# Altium schematic sheet Main_Sheet.SchDoc
size A4; SheetNumber: 1; SheetTotal: 4
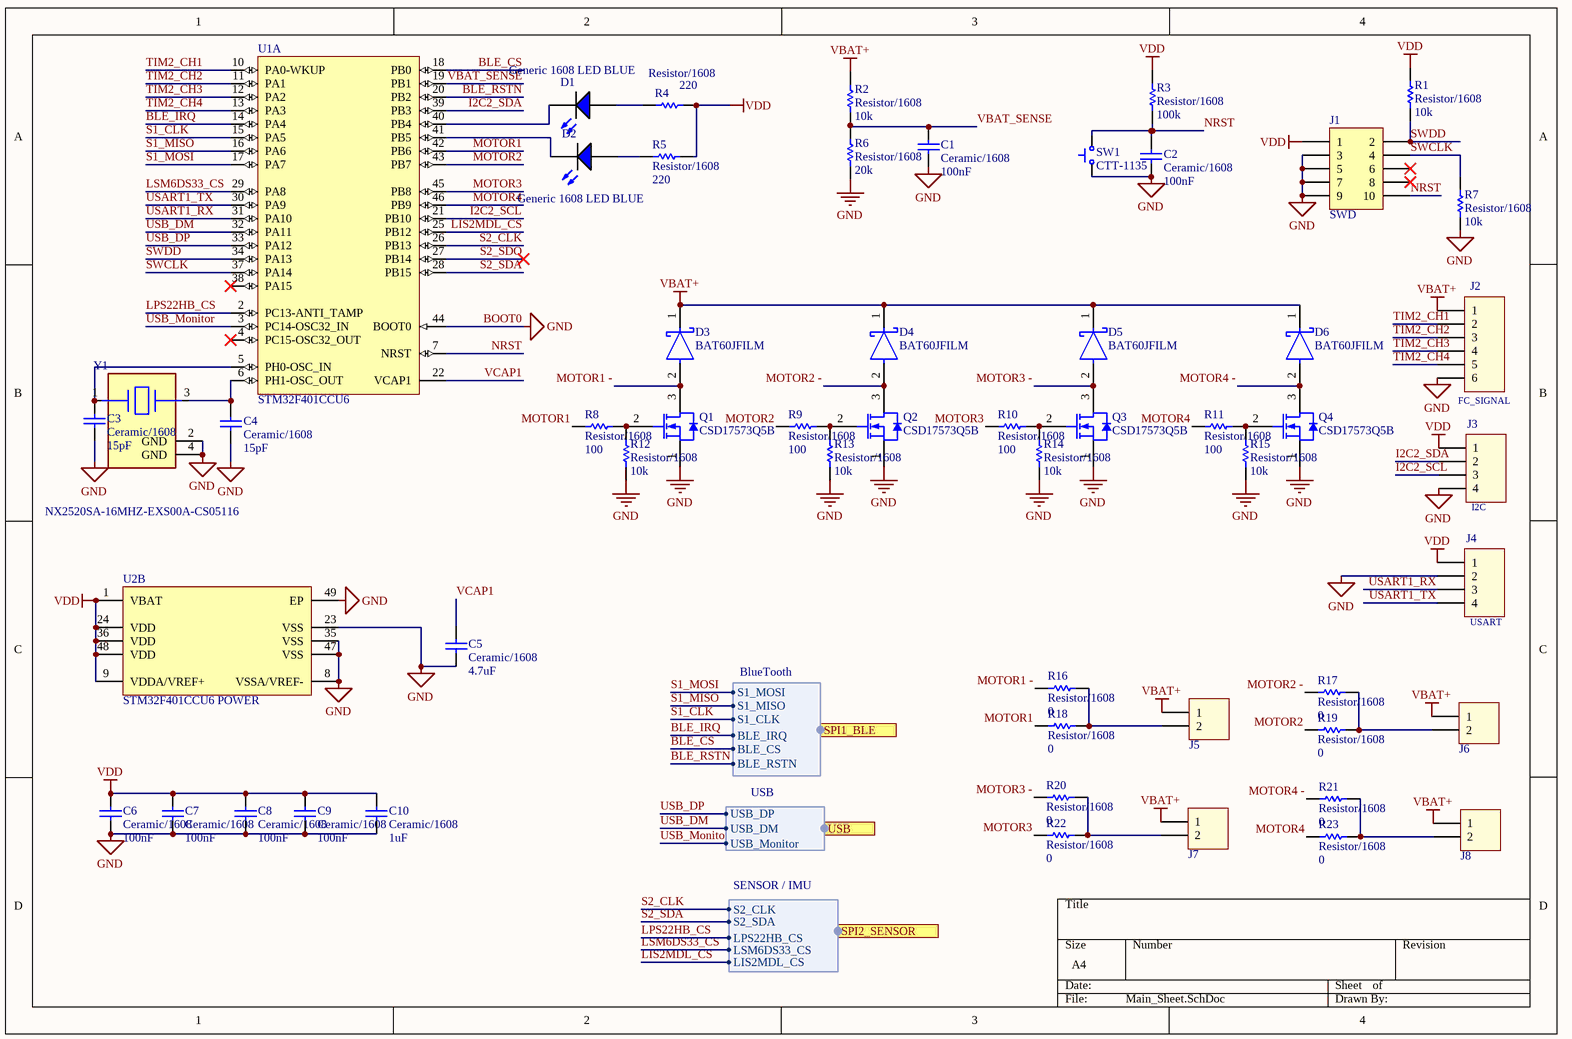
[diagram p0: Main_Sheet.SchDoc]

## Parts
C1  Ceramic/1608  value 100nF  [Generic 1608 Ceramic]
C2  Ceramic/1608  value 100nF  [Generic 1608 Ceramic]
C3  Ceramic/1608  value 15pF  [Generic 1608 Ceramic]
C4  Ceramic/1608  value 15pF  [Generic 1608 Ceramic]
C5  Ceramic/1608  value 4.7uF  [Generic 1608 Ceramic]
C6  Ceramic/1608  value 100nF  [Generic 1608 Ceramic]
C7  Ceramic/1608  value 100nF  [Generic 1608 Ceramic]
C8  Ceramic/1608  value 100nF  [Generic 1608 Ceramic]
C9  Ceramic/1608  value 100nF  [Generic 1608 Ceramic]
C10  Ceramic/1608  value 1uF  [Generic 1608 Ceramic]
D1  Generic 1608 LED BLUE  [Generic 1608 LED BLUE-Footprint-1]
D2  Generic 1608 LED BLUE  [Generic 1608 LED BLUE-Footprint-1]
D3  BAT60JFILM  [FP-BAT60JFILM-MFG]
D4  BAT60JFILM  [FP-BAT60JFILM-MFG]
D5  BAT60JFILM  [FP-BAT60JFILM-MFG]
D6  BAT60JFILM  [FP-BAT60JFILM-MFG]
J1  SWD  [3220-10-0300-00-Footprint-1]
J2  FC_SIGNAL  [61300611121]
J3  I2C  [61300411121]
J4  USART  [61300411121]
J5  61300211121  [61300211121]  (value not drawn)
J6  61300211121  [61300211121]  (value not drawn)
J7  61300211121  [61300211121]  (value not drawn)
J8  61300211121  [61300211121]  (value not drawn)
Q1  CSD17573Q5B  [CSD16342Q5A-Footprint-1]
Q2  CSD17573Q5B  [CSD16342Q5A-Footprint-1]
Q3  CSD17573Q5B  [CSD16342Q5A-Footprint-1]
Q4  CSD17573Q5B  [CSD16342Q5A-Footprint-1]
R1  Resistor/1608  value 10k  [Resistor 1608-Footprint]
R2  Resistor/1608  value 10k  [Resistor 1608-Footprint]
R3  Resistor/1608  value 100k  [Resistor 1608-Footprint]
R4  Resistor/1608  value 220  [Resistor 1608-Footprint]
R5  Resistor/1608  value 220  [Resistor 1608-Footprint]
R6  Resistor/1608  value 20k  [Resistor 1608-Footprint]
R7  Resistor/1608  value 10k  [Resistor 1608-Footprint]
R8  Resistor/1608  value 100  [Resistor 1608-Footprint]
R9  Resistor/1608  value 100  [Resistor 1608-Footprint]
R10  Resistor/1608  value 100  [Resistor 1608-Footprint]
R11  Resistor/1608  value 100  [Resistor 1608-Footprint]
R12  Resistor/1608  value 10k  [Resistor 1608-Footprint]
R13  Resistor/1608  value 10k  [Resistor 1608-Footprint]
R14  Resistor/1608  value 10k  [Resistor 1608-Footprint]
R15  Resistor/1608  value 10k  [Resistor 1608-Footprint]
R16  Resistor/1608  value 0  [Resistor 1608-Footprint]
R17  Resistor/1608  value 0  [Resistor 1608-Footprint]
R18  Resistor/1608  value 0  [Resistor 1608-Footprint]
R19  Resistor/1608  value 0  [Resistor 1608-Footprint]
R20  Resistor/1608  value 0  [Resistor 1608-Footprint]
R21  Resistor/1608  value 0  [Resistor 1608-Footprint]
R22  Resistor/1608  value 0  [Resistor 1608-Footprint]
R23  Resistor/1608  value 0  [Resistor 1608-Footprint]
SW1  CTT-1135  [CTT-1135-Footprint-1]
U1  STM32F401CCU6  [STM-UFQFPN48_N]  (part A of 2)
U2  STM32F401CCU6 POWER  [STM-UFQFPN48_N]  (part B of 2)
Y1  NX2520SA-16MHZ-EXS00A-CS05116  [FP-NX2520SA-MFG]

## Ports
SPI1_BLE (harness BlueTooth), SPI2_SENSOR (harness SENSOR / IMU), USB (harness USB)

## Harnesses
BlueTooth: S1_CLK, S1_MISO, S1_MOSI, BLE_IRQ, BLE_CS, BLE_RSTN
USB: USB_DM, USB_DP, USB_Monitor
SENSOR / IMU: LPS22HB_CS, S2_SDA, S2_CLK, LSM6DS33_CS, LIS2MDL_CS

## Nets
BOOT0: C1.1 C2.1 C3.1 C4.1 C5.1 C6.1 C7.1 C8.1 C9.1 C10.1 J1.3 J1.5 J1.7 J1.9 J2.6 J3.4 J4.2 Q1.1(S) Q2.1(S) Q3.1(S) Q4.1(S) R6.1 R7.1 R12.1 R13.1 R14.1 R15.1 SW1.1 U1.44(BOOT0) U2.8(VSSA/VREF-) U2.23(VSS) U2.35(VSS) U2.47(VSS) U2.49(EP) Y1.2(GND) Y1.4(GND)  [also labelled GND]
VBAT+: D3.1(K) D4.1(K) D5.1(K) D6.1(K) J2.1 J5.1 J6.1 J7.1 J8.1 R2.2
VDD: C6.2 C7.2 C8.2 C9.2 C10.2 J1.1 J3.1 J4.1 R1.2 R3.2 R4.2 R5.2 U2.1(VBAT) U2.9(VDDA/VREF+) U2.24(VDD) U2.36(VDD) U2.48(VDD)
BLE_CS: U1.18(PB0) ; port SPI1_BLE.BLE_CS
BLE_IRQ: U1.14(PA4) ; port SPI1_BLE.BLE_IRQ
BLE_RSTN: U1.20(PB2) ; port SPI1_BLE.BLE_RSTN
I2C2_SCL: J3.3 U1.21(PB10)
I2C2_SDA: J3.2 U1.39(PB3)
LIS2MDL_CS: U1.25(PB12) ; port SPI2_SENSOR.LIS2MDL_CS
LPS22HB_CS: U1.2(PC13-ANTI_TAMP) ; port SPI2_SENSOR.LPS22HB_CS
LSM6DS33_CS: U1.29(PA8) ; port SPI2_SENSOR.LSM6DS33_CS
MOTOR1: R8.1 R18.1 U1.42(PB6)
MOTOR1 -: D3.2(A) Q1.3(D) R16.1
MOTOR2: R9.1 R19.1 U1.43(PB7)
MOTOR2 -: D4.2(A) Q2.3(D) R17.1
MOTOR3: R10.1 R22.1 U1.45(PB8)
MOTOR3 -: D5.2(A) Q3.3(D) R20.1
MOTOR4: R11.1 R23.1 U1.46(PB9)
MOTOR4 -: D6.2(A) Q4.3(D) R21.1
NRST: C2.2 J1.10 R3.1 SW1.2 U1.7(NRST)
S1_CLK: U1.15(PA5) ; port SPI1_BLE.S1_CLK
S1_MISO: U1.16(PA6) ; port SPI1_BLE.S1_MISO
S1_MOSI: U1.17(PA7) ; port SPI1_BLE.S1_MOSI
S2_CLK: U1.26(PB13) ; port SPI2_SENSOR.S2_CLK
S2_SDA: U1.28(PB15) ; port SPI2_SENSOR.S2_SDA
S2_SDO: U1.27(PB14)
SWCLK: J1.4 R7.2 U1.37(PA14)
SWDD: J1.2 R1.1 U1.34(PA13)
TIM2_CH1: J2.2 U1.10(PA0-WKUP)
TIM2_CH2: J2.3 U1.11(PA1)
TIM2_CH3: J2.4 U1.12(PA2)
TIM2_CH4: J2.5 U1.13(PA3)
USART1_RX: J4.3 U1.31(PA10)
USART1_TX: J4.4 U1.30(PA9)
USB_DM: U1.32(PA11) ; port USB.USB_DM
USB_DP: U1.33(PA12) ; port USB.USB_DP
USB_Monitor: U1.3(PC14-OSC32_IN) ; port USB.USB_Monitor
VBAT_SENSE: C1.2 R2.1 R6.2 U1.19(PB1)
VCAP1: C5.2 U1.22(VCAP1)
NetC3_2: C3.2 U1.5(PH0-OSC_IN) Y1.1
NetC4_2: C4.2 U1.6(PH1-OSC_OUT) Y1.3
NetD1_1: D1.1(A) R4.1
NetD1_2: D1.2(K) U1.40(PB4)
NetD2_1: D2.1(A) R5.1
NetD2_2: D2.2(K) U1.41(PB5)
NetJ5_2: J5.2 R16.2 R18.2
NetJ6_2: J6.2 R17.2 R19.2
NetJ7_2: J7.2 R20.2 R22.2
NetJ8_2: J8.2 R21.2 R23.2
NetQ1_2: Q1.2(G) R8.2 R12.2
NetQ2_2: Q2.2(G) R9.2 R13.2
NetQ3_2: Q3.2(G) R10.2 R14.2
NetQ4_2: Q4.2(G) R11.2 R15.2

Not connected (* = marked no-connect by the designer): J1 6* 8*; U1 4(PC15-OSC32_OUT)* 38(PA15)*

## Library data of the parts
C1-C10 = CMP-002-0009-3: Generic 1608 Ceramic Capacitor; Capacitor Type: Ceramic; Pins: 2; Mount: SMD; Case/Package: 1608; RoHS: Yes
D1 D2 = CMP-008-0003-2: Generic 1608 LED <BLUE>
D3-D6 = CMP-12187-000028-1: DIODE SCHOTTKY 10V 3A SOD323; Max Forward Surge Current (Ifsm): 5A; Forward Voltage: 580mV; Max Reverse Leakage Current: 7.5uA; Element Configuration: Single; Polarity: Standard; Output Current: 3A; Contact Plating: Tin; Package Quantity: 1; Mount: Surface Mount; Min Operating Temperature: -65°C; Average Rectified Current: 3A; Packaging: Tape and Reel; Forward Current: 3A; Height: 1.07mm; Length: 1.8mm; REACH SVHC: No SVHC; Peak Non-Repetitive Surge Current: 5A; Max Surge Current: 5A; Width: 1.45mm; Current Rating: 3A; Lead Free: Lead Free; Radiation Hardening: No; Max Reverse Voltage (DC): 10V; Peak Reverse Current: 7.5uA; Voltage Rating (DC): 10V; Max Operating Temperature: 150°C; Max Repetitive Reverse Voltage (Vrrm): 10V; Number of Pins: 2; Weight: 0.01lb
J1 = CMP-ROOT-00062-1: CONN HEADER SMD 10POS 1.27MM; Pitch: 0.05inch; Number of Positions: 10; Connector Type: Male Pin; Mount: Surface Mount; Packaging: Tray; Contact Plating: Gold; Termination: Solder; Number of Rows: 2; RoHS: Yes; Package Quantity: 3200; Row Spacing: 0.05inch
J2 = CMP-005-0062-1: Pin Header WR-PHD, pitch 2.54 mm, THT, Vertical, single row, 6 pin; Contact Resistance: 20 mOhm; Insulation Resistance: >1000 MOhm; Pin Number: 6; Pitch: 2.54 mm; Rated Current: 3 A; Working Voltage: 250 VAC; Component Name: 61300611121; ComponentLink1Description: Manufacturer; ComponentLink1URL: http://www.we-online.de; ComponentLink2Description: Datasheet; ComponentLink2URL: http://katalog.we-online.de/em/datasheet/6130xx11121.pdf; Designator: 61300611121; Mounting Technology: THT; Operating Temperature: -40 to 105 degC; Orientation: Vertical; Part Number: 61300611121; Pin Count: 6; Published Date: Jan. 2018; Publisher: Wurth Elektronik; Row Number: Single
J3 J4 = CMP-005-0056-1: Pin Header WR-PHD, pitch 2.54 mm, THT, Vertical, single row, 4 pin; Contact Resistance: 20 mOhm; Insulation Resistance: >1000 MOhm; Pin Number: 4; Pitch: 2.54 mm; Rated Current: 3 A; Working Voltage: 250 VAC; Component Name: 61300411121; ComponentLink1Description: Manufacturer; ComponentLink1URL: http://www.we-online.de; ComponentLink2Description: Datasheet; ComponentLink2URL: http://katalog.we-online.de/em/datasheet/6130xx11121.pdf; Designator: 61300411121; Mounting Technology: THT; Operating Temperature: -40 to 105 degC; Orientation: Vertical; Part Number: 61300411121; Pin Count: 4; Published Date: Jan. 2018; Publisher: Wurth Elektronik; Row Number: Single
J5-J8 = CMP-005-0052-1: Pin Header WR-PHD, pitch 2.54 mm, THT, Vertical, single row, 2 pin; Contact Resistance: 20 mOhm; Insulation Resistance: >1000 MOhm; Pin Number: 2; Pitch: 2.54 mm; Rated Current: 3 A; Working Voltage: 250 VAC; Component Name: 61300211121; ComponentLink1Description: Manufacturer; ComponentLink1URL: http://www.we-online.de; ComponentLink2Description: Datasheet; ComponentLink2URL: http://katalog.we-online.de/em/datasheet/6130xx11121.pdf; Designator: 61300211121; Mounting Technology: THT; Operating Temperature: -40 to 105 degC; Orientation: Vertical; Part Number: 61300211121; Pin Count: 2; Published Date: Jan. 2018; Publisher: Wurth Elektronik; Row Number: Single
Q1-Q4 = CMP-014-0005-2: Trans MOSFET N-CH 30V 100A 8-Pin SON T/R; pin to pad: 1>1+2+3 2>4 3>5+6+7+8; Turn-On Delay Time: 6ns; Max Power Dissipation: 3.2W; Rds On Max: 1mR; Turn-Off Delay Time: 40ns; Gate to Source Voltage (Vgs): 20V; Input Capacitance: 9nF; Element Configuration: Single; Rise Time: 20ns; Fall Time: 7ns; Max Operating Temperature: 150°C; Contact Plating: Nickel, Gold; Mount: Surface Mount; Lead Free: Contains Lead; Number of Pins: 8; Drain to Source Voltage (Vdss): 30V; Continuous Drain Current (ID): 100A; Packaging: Tape and Reel; Min Operating Temperature: -55°C
R1-R23 = CMP-001-0018-2: Generic 1608 Resistor; Pins: 2; Case/Package: Bulk; RoHS: Yes; Mount: SMD
SW1 = CMP-013-0003-1: 3.9x2.9x2.0 SMD  Tact switch; RoHS: Yes; Case/Package: 3.9x2.9x2.0; Mount: SMD; Pins: 2
U1 U2 = CMP-0243-00119-2: ARM Cortex-M4 32-bit MCU+FPU, 105 DMIPS, 256 kB Flash, 64 kB Internal RAM, 36 I/Os, 48-pin UFQFPN, -40 to 85 degC, Tray; Manufacturer: STMicroelectronics; Supply Voltage(Vcc) max (V): 3.6; I/Os (High Current): 36; Internal RAM Size (kB): 64; Operating Frequency(F) (Processor speed) (MHz): 84; FLASH Size (Prog) (kB): 256; Supply Voltage(Vcc) min (V): 1.8; Packing: Tray; PackageReference: UFQFPN48; PackageVersion: Rev. 1, 04/2013; Core: ARM Cortex-M4; ComponentLink1Description: Manufacturer URL; ComponentLink3Description: Package Specification; PackageDescription: 48-Pin Ultra Thin Fine Pitch Quad Flat No-Lead, 7 x 7 x 0.6 mm Body, 0.5 mm Pitch, Exposed Pad; Mounting Technology: Surface Mount; ComponentLink2URL: http://www.st.com/st-web-ui/static/active/en/resource/technical/document/data_brief/DM00071938.pdf; DatasheetVersion: Rev. 1; ComponentLink2Description: Datasheet; ComponentLink1URL: http://www.st.com/web/en/home.html; PartNumber: STM32F401CCU6; ComponentLink3URL: http://www.st.com/st-web-ui/static/active/en/resource/technical/document/data_brief/DM00071938.pdf
Y1 = CMP-2000-05279-2: CRYSTAL 16.0000MHZ 12PF SMD; Series Resistance: 80R; Frequency: 16MHz; Frequency Tolerance: 15ppm; Frequency Stability: 25ppm; Mount: Surface Mount; Height: 0.022inch; Length: 0.098inch; ESR (Equivalent Series Resistance): 80R; Packaging: Tape and Reel; Min Operating Temperature: -40°C; Width: 0.079inch; Number of Pins: 4; Case/Package: SMD/SMT; Max Operating Temperature: 85°C; Load Capacitance: 12pF; Package Quantity: 3000